# Altium schematic sheet Battery_MGMT.SchDoc
size A; SheetNumber: 2; SheetTotal: 3
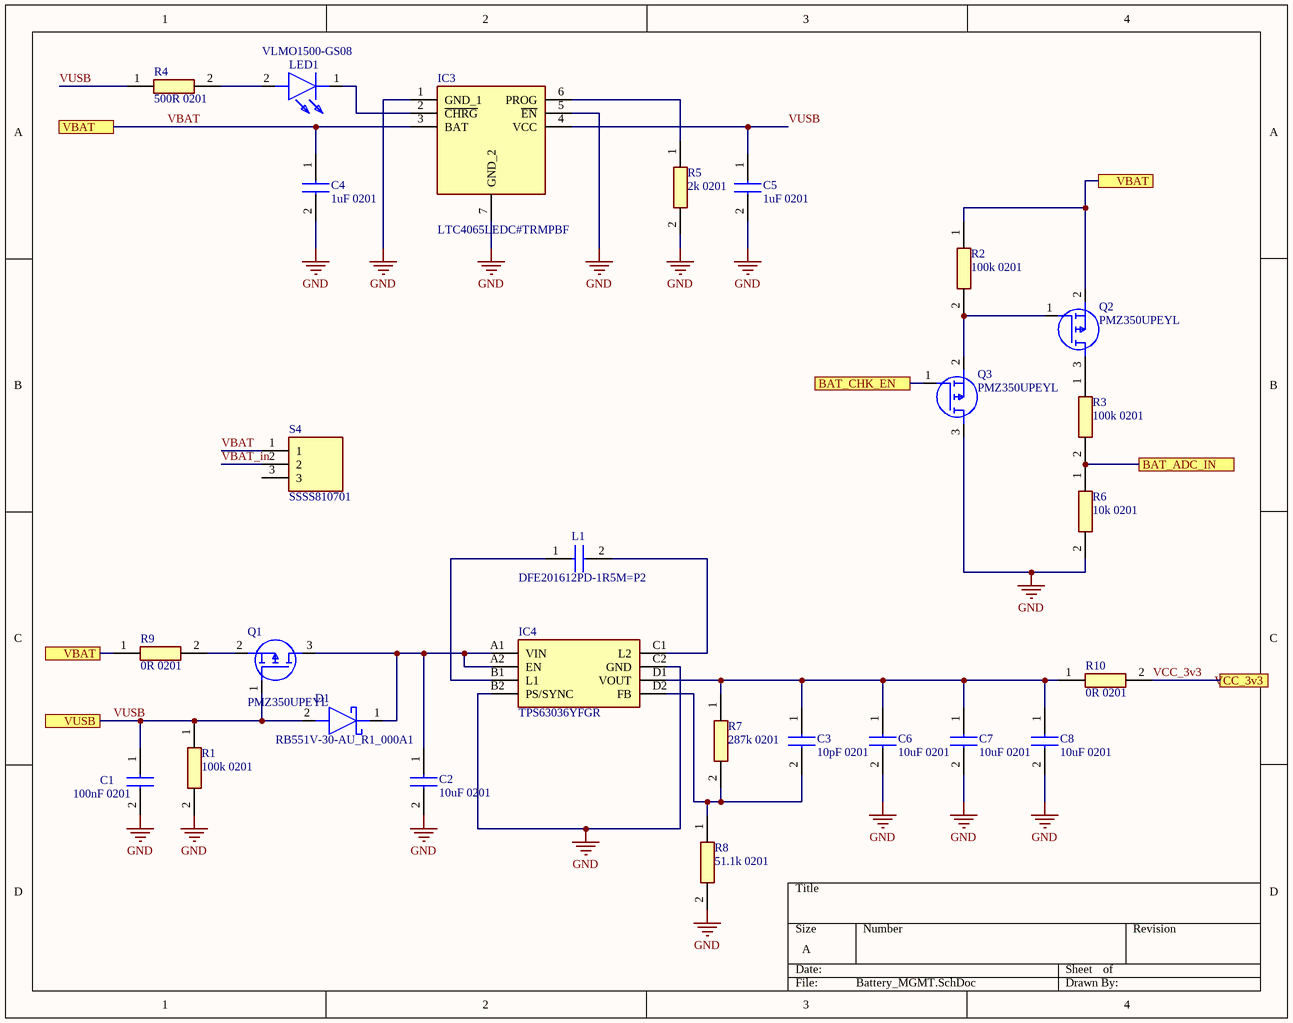
[diagram p0: Battery_MGMT.SchDoc]

## Parts
C1  100nF 0201  [CAPC0603X33N]
C2  10uF 0201  [CAPC0603X33N]
C3  10pF 0201  [CAPC0603X33N]
C4  1uF 0201  [CAPC0603X33N]
C5  1uF 0201  [CAPC0603X33N]
C6  10uF 0201  [CAPC0603X33N]
C7  10uF 0201  [CAPC0603X33N]
C8  10uF 0201  [CAPC0603X33N]
D1  RB551V-30-AU_R1_000A1  [SODFL2512X90N]
IC3  LTC4065LEDC#TRMPBF  [SON50P200X200X80-7N-D]
IC4  TPS63036YFGR  [BGA8C40P2X4_108X181X62]
L1  DFE201612PD-1R5M=P2  [1286ASH1R0MP2]
LED1  VLMO1500-GS08  [VLMO1500GS08]
Q1  PMZ350UPEYL  [PMZ350UPEYL]
Q2  PMZ350UPEYL  [PMZ350UPEYL]
Q3  PMZ350UPEYL  [PMZ350UPEYL]
R1  100k 0201  [RESC0603X28N]
R2  100k 0201  [RESC0603X28N]
R3  100k 0201  [RESC0603X28N]
R4  500R 0201  [RESC0603X28N]
R5  2k 0201  [RESC0603X28N]
R6  10k 0201  [RESC0603X28N]
R7  287k 0201  [RESC0603X28N]
R8  51.1k 0201  [RESC0603X28N]
R9  0R 0201  [RESC0603X28N]
R10  0R 0201  [RESC0603X28N]
S4  SSSS810701  [SSSS810701]

## Ports
BAT_ADC_IN (see AD5940PSTAT[3C]), BAT_CHK_EN (see AD5940PSTAT[3C]), VBAT (see Battery_MGMT[1A], Battery_MGMT[1C]), VBAT (see Battery_MGMT[1A], Battery_MGMT[4A]), VBAT (see Battery_MGMT[1C], Battery_MGMT[4A]), VCC_3v3 (see AD5940[2C], AD5940PSTAT[2A]), VUSB (see AD5940PSTAT[1A], AD5940PSTAT[2A])

## Nets
GND: C1.2 C2.2 C4.2 C5.2 C6.2 C7.2 C8.2 IC3.1(GND_1) IC3.5(~{EN}) IC3.7(GND_2) IC4.B2(PS/SYNC) IC4.C2(GND) Q3.3(D) R1.2 R5.2 R6.2 R8.2
BAT_ADC_IN: R3.2 R6.1 ; port BAT_ADC_IN
BAT_CHK_EN: Q3.1(G) ; port BAT_CHK_EN
VBAT: C4.1 IC3.3(BAT) Q2.2(S) R2.1 R9.1 S4.1 ; port VBAT
VBAT_in: S4.2
VCC_3v3: R10.2 ; port VCC_3v3
VUSB: C1.1 C5.1 D1.2(A) IC3.4(VCC) Q1.1(G) R1.1 R4.1 ; port VUSB
NetC2_1: C2.1 D1.1(K) IC4.A1(VIN) IC4.A2(EN) Q1.3(D)
NetC3_1: C3.1 C6.1 C7.1 C8.1 IC4.D1(VOUT) R7.1 R10.1
NetC3_2: C3.2 IC4.D2(FB) R7.2 R8.1
NetIC3_2: IC3.2(~{CHRG}) LED1.1(K)
NetIC3_6: IC3.6(PROG) R5.1
NetIC4_B1: IC4.B1(L1) L1.1
NetIC4_C1: IC4.C1(L2) L1.2
NetLED1_2: LED1.2(A) R4.2
NetQ1_2: Q1.2(S) R9.2
NetQ2_1: Q2.1(G) Q3.2(S) R2.2
NetQ2_3: Q2.3(D) R3.1

Not connected (* = marked no-connect by the designer): S4 3

## Library data of the parts
C1-C8 = 02013A0R5BAT2A: Capacitor; Manufacturer_Name: Kyocera AVX; Datasheet Link: http://www.mouser.com/catalog/supplier/library/pdf/AVXSurfaceMountCeramic.pdf; Height: 0.33mm; Manufacturer_Part_Number: 02013A0R5BAT2A; Mouser Part Number: 581-02013A0R5BAT2A; Mouser Price/Stock: https://www.mouser.co.uk/ProductDetail/KYOCERA-AVX/02013A0R5BAT2A?qs=Thry1QCnmXDPtFIq9lj3NA%3D%3D
D1 = RB551V-30-AU_R1_000A1: Schottky Diode; Manufacturer_Name: PANJIT; Datasheet Link: https://www.panjit.com.tw/upload/datasheet/RB551V-30-AU.pdf; Height: 0.9mm; Manufacturer_Part_Number: RB551V-30-AU_R1_000A1; Mouser Part Number: 241-RB551V30AUR1000A; Mouser Price/Stock: https://www.mouser.co.uk/ProductDetail/Panjit/RB551V-30-AU_R1_000A1?qs=sPbYRqrBIVm52pGNMRAOZw%3D%3D
IC3 = LTC4065LEDC#TRMPBF: Integrated Circuit; Manufacturer_Name: Analog Devices; Datasheet Link: https://www.analog.com/media/en/technical-documentation/data-sheets/LTC4065L-4065LX-4065L-4.1-4065LX-4.1.pdf; Height: 0.8mm; Manufacturer_Part_Number: LTC4065LEDC#TRMPBF; Mouser Part Number: 584-C4065LEDCTRMPBF; Mouser Price/Stock: https://www.mouser.co.uk/ProductDetail/Analog-Devices/LTC4065LEDCTRMPBF?qs=hVkxg5c3xu8%2FWtpri9P%2FRQ%3D%3D; Arrow Part Number: LTC4065LEDC#TRMPBF; Arrow Price/Stock: https://www.arrow.com/en/products/ltc4065ledctrmpbf/analog-devices
IC4 = TPS63036YFGR: Integrated Circuit; Manufacturer_Name: Texas Instruments; Datasheet Link: http://www.ti.com/lit/gpn/tps63036; Height: 0.625mm; Manufacturer_Part_Number: TPS63036YFGR; Mouser Part Number: 595-TPS63036YFGR; Mouser Price/Stock: https://www.mouser.co.uk/ProductDetail/Texas-Instruments/TPS63036YFGR?qs=VMlqFFbv3sRsnODi5hD5bA%3D%3D; Arrow Part Number: TPS63036YFGR; Arrow Price/Stock: https://www.arrow.com/en/products/tps63036yfgr/texas-instruments?region=nac
L1 = DFE201612PD-1R5M=P2: Capacitor; Manufacturer_Name: Murata Electronics; Datasheet Link: https://search.murata.co.jp/Ceramy/image/img/P02/J(E)TE243A-9101.pdf; Height: 1.2mm; Manufacturer_Part_Number: DFE201612PD-1R5M=P2; Mouser Part Number: 81-DFE201612PD1R5P2; Mouser Price/Stock: https://www.mouser.co.uk/ProductDetail/Murata-Electronics/DFE201612PD-1R5M%3dP2?qs=55YtniHzbhABc8Y8Zkr7yw%3D%3D; Arrow Part Number: DFE201612PD-1R5M=P2; Arrow Price/Stock: https://www.arrow.com/en/products/dfe201612pd-1r5mp2/murata-manufacturing
LED1 = VLMO1500-GS08: LED; Manufacturer_Name: Vishay; Datasheet Link: https://www.vishay.com/docs/82554/vlmo1500.pdf; Manufacturer_Part_Number: VLMO1500-GS08; Mouser Part Number: 78-VLMO1500-GS08; Mouser Price/Stock: https://www.mouser.co.uk/ProductDetail/Vishay-Semiconductors/VLMO1500-GS08?qs=2BArZ0I3QlmyRfxEaZ%252BeBw%3D%3D; Arrow Part Number: VLMO1500-GS08; Arrow Price/Stock: https://www.arrow.com/en/products/vlmo1500-gs08/vishay
Q1-Q3 = PMZ350UPEYL: MOSFET (P-Channel); Manufacturer_Name: Nexperia; Datasheet Link: https://assets.nexperia.com/documents/data-sheet/PMZ350UPE.pdf; Height: 0.5mm; Manufacturer_Part_Number: PMZ350UPEYL; Mouser Part Number: 771-PMZ350UPEYL; Mouser Price/Stock: https://www.mouser.co.uk/ProductDetail/Nexperia/PMZ350UPEYL?qs=8qdoF%2F2f1vquuPCxXPSa%252BA%3D%3D; Arrow Part Number: PMZ350UPEYL; Arrow Price/Stock: https://www.arrow.com/en/products/pmz350upeyl/nexperia?utm_currency=USD&region=nac
R1-R10 = CPF0201D422RE1: Resistor; Manufacturer_Name: TE Connectivity; Datasheet Link: http://www.te.com/commerce/DocumentDelivery/DDEController?Action=showdoc&DocId=Data+Sheet%7F1773200-1%7FA%7Fpdf%7FEnglish%7FENG_DS_1773200-1_A.pdf%7F4-2176215-6; Height: 0.28mm; Manufacturer_Part_Number: CPF0201D422RE1
S4 = SSSS810701: Switch; Manufacturer_Name: ALPS Electric; Datasheet Link: http://www.alps.com/prod/info/E/HTML/Switch/Slide/SSSS8/SSSS810701.html; Manufacturer_Part_Number: SSSS810701; Mouser Part Number: 688-SSSS810701; Mouser Price/Stock: https://www.mouser.co.uk/ProductDetail/Alps-Alpine/SSSS810701?qs=uROlC5LSwk1OL7pdbC2yLg%3D%3D; Arrow Part Number: SSSS810701; Arrow Price/Stock: https://www.arrow.com/en/products/ssss810701/alps-electric